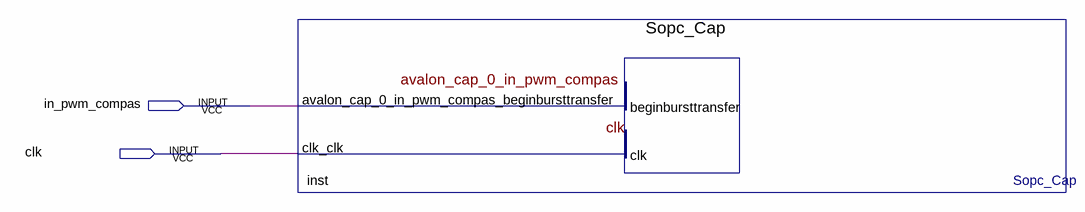
[diagram p0: schematic sheet]
// Quartus schematic cap_block.bdf as structural Verilog: 1 symbols, 2 pins
module cap_block (
  input  in_pwm_compas,
  input  clk
);

  Sopc_Cap inst (.avalon_cap_0_in_pwm_compas_beginbursttransfer(in_pwm_compas), .clk_clk(clk));
endmodule
